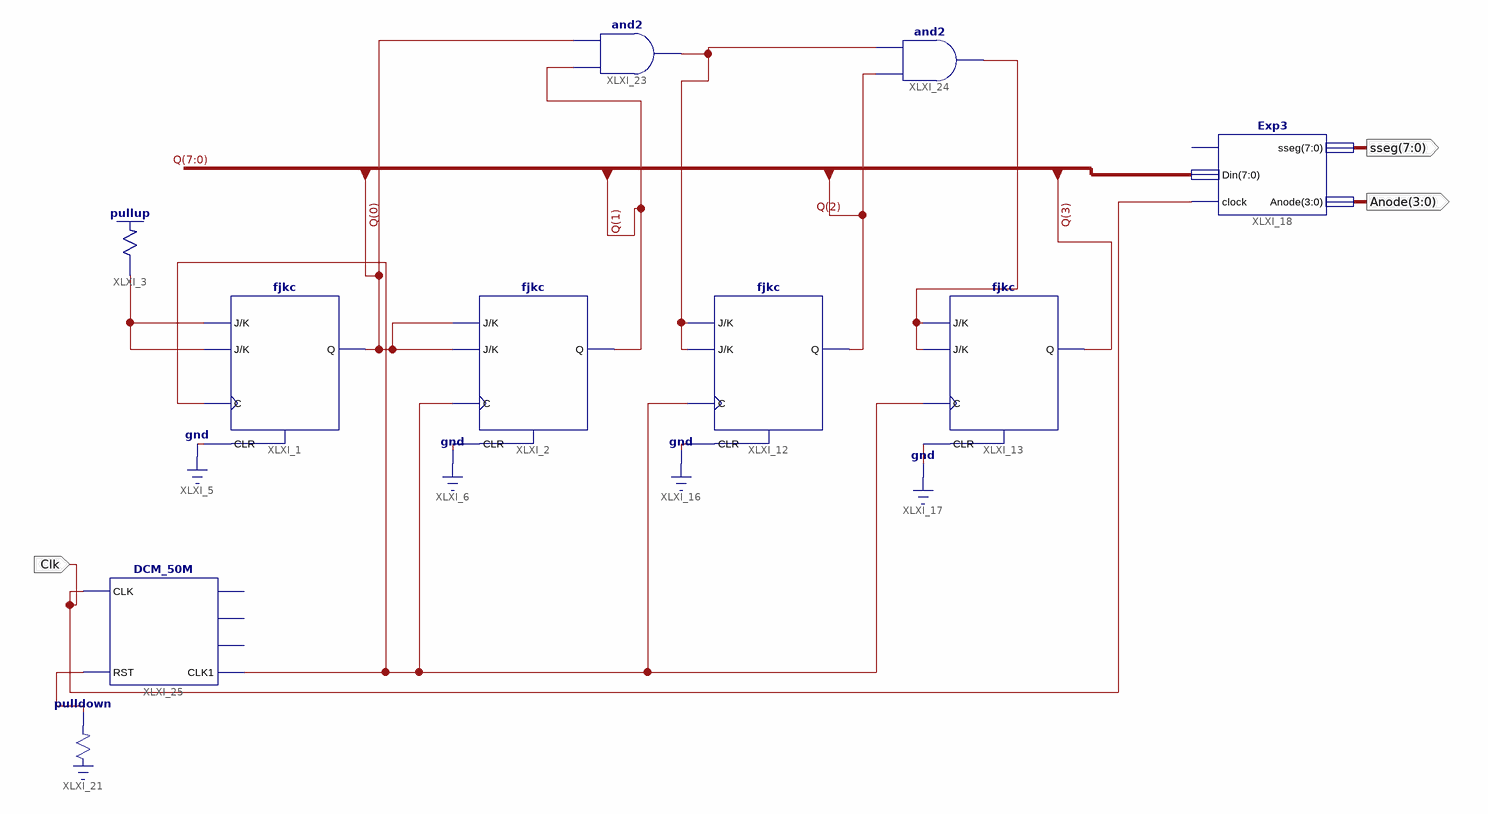
[diagram p0: schematic sheet 1]
// Xilinx ISE schematic Exp5BasicJKSyncCounter.sch (spartan3e) as structural Verilog: 10 symbols, 3 ports
module Exp5BasicJKSyncCounter (
  input  Clk,
  output [7:0] sseg,
  output [3:0] Anode
);

  wire XLXN_1, XLXN_50, XLXN_52, XLXN_57, XLXN_58;
  wire [7:0] Q;

  fjkc XLXI_1 (.C(XLXN_58), .CLR(1'b0), .J(XLXN_1), .K(XLXN_1), .Q(Q[0]));
  \pullup  XLXI_3 (.O(XLXN_1));
  fjkc XLXI_2 (.C(XLXN_58), .CLR(1'b0), .J(Q[0]), .K(Q[0]), .Q(Q[1]));
  fjkc XLXI_12 (.C(XLXN_58), .CLR(1'b0), .J(XLXN_50), .K(XLXN_50), .Q(Q[2]));
  fjkc XLXI_13 (.C(XLXN_58), .CLR(1'b0), .J(XLXN_52), .K(XLXN_52), .Q(Q[3]));
  Exp3 XLXI_18 (.Din(Q), .clock(Clk), .sseg(sseg), .Anode(Anode));  // open: ButtonEn
  \pulldown  XLXI_21 (.O(XLXN_57));
  and XLXI_23 (XLXN_50, Q[1], Q[0]);
  and XLXI_24 (XLXN_52, Q[2], XLXN_50);
  DCM_50M XLXI_25 (.CLK(Clk), .RST(XLXN_57), .CLK1(XLXN_58));  // open: CLK1M, CLK10k, CLK1k
endmodule
